# Altium project PirSwitch.PrjPCB
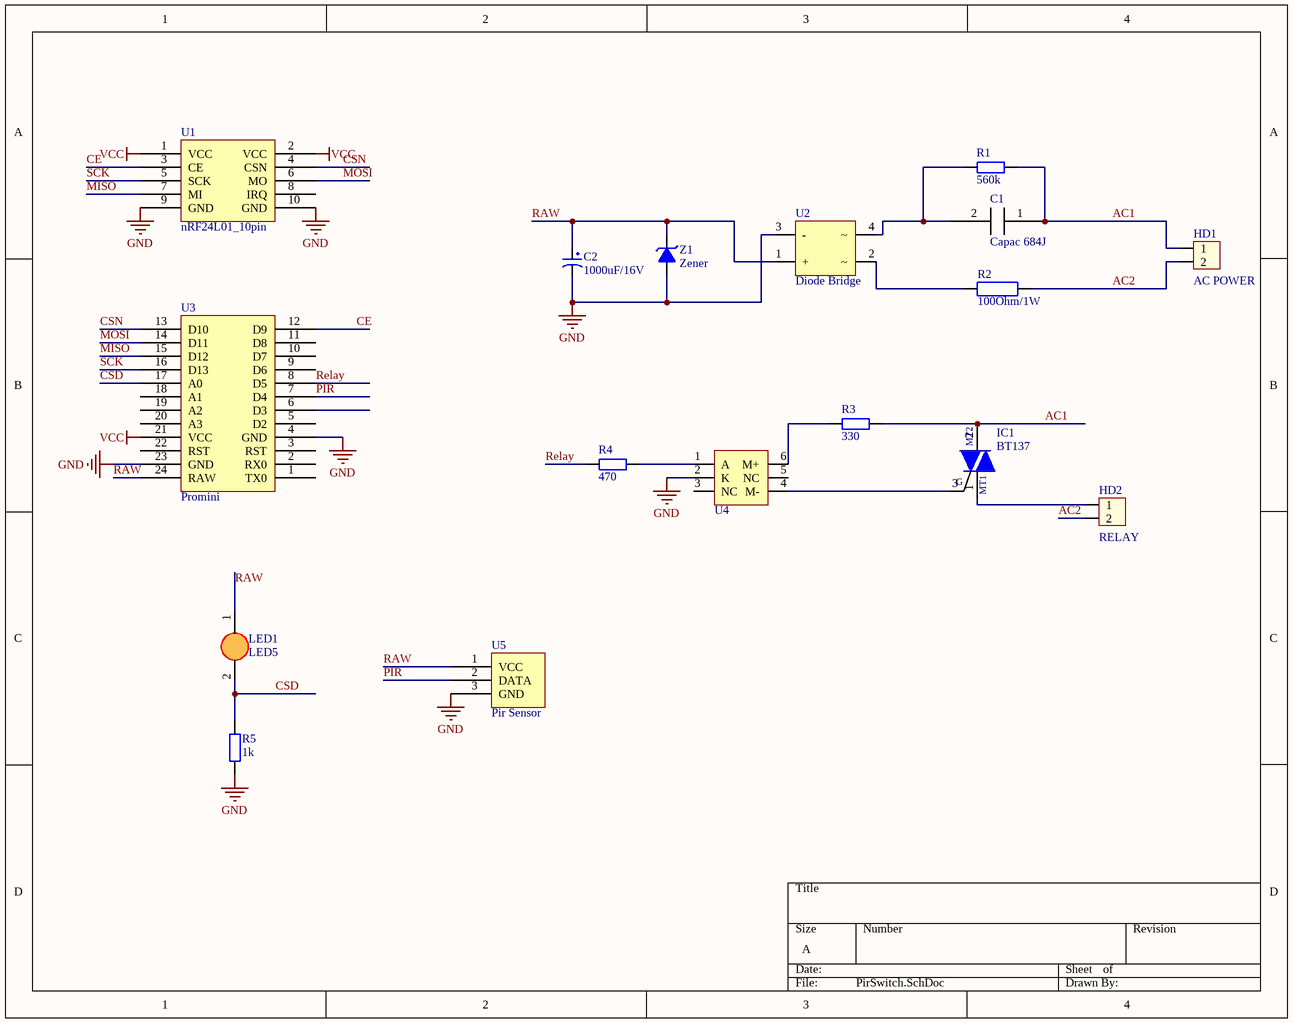
[diagram p0: PirSwitch.SchDoc]
1 sheet, 17 parts. Net scope: global (net labels, ports and power ports of the same name join across sheets).
Board file: PirSwitch.PcbDoc

## Sheet PirSwitch.SchDoc
size A

### Parts
C1  Capac 684J  [Tu keo 684J 400V]
C2  1000uF/16V  [CP2/4]
HD1  AC POWER  [HED2]
HD2  RELAY  [HED2]
IC1  BT137  [QTO-220]
LED1  LED5  [LED5MM]
R1  560k  [R1/4W]
R2  100Ohm/1W  [RES1W]
R3  330  [R1/4W]
R4  470  [R1/4W]
R5  1k  [R1/4W]
U1  nRF24L01_10pin  [NRF24L01_10PIN]
U2  Diode Bridge  [DIODE BRIDGE]
U3  Promini  [Promini]
U4  MOC3021M  [MOC30XX]  (value not drawn)
U5  Pir Sensor  [PIRSENSOR]
Z1  Zener  [D1A]

### Nets
GND: C2.2 R5.1 U1.9(GND) U1.10(GND) U2.3(-) U3.4(GND) U3.23(GND) U4.2(K) U5.3(GND) Z1.1(A)
VCC: U1.1(VCC) U1.2(VCC) U3.21(VCC)
AC1: C1.1 HD1.1 IC1.2(MT2) R1.2 R3.2
AC2: HD1.2 HD2.2 R2.2
CE: U1.3(CE) U3.12(D9)
CSD: LED1.2(K) R5.2 U3.17(A0)
CSN: U1.4(CSN) U3.13(D10)
MISO: U1.7(MI) U3.15(D12)
MOSI: U1.6(MO) U3.14(D11)
PIR: U3.7(D4) U5.2(DATA)
RAW: C2.1 LED1.1(A) U2.1(+) U3.24(RAW) U5.1(VCC) Z1.2(K)
Relay: R4.1 U3.8(D5)
SCK: U1.5(SCK) U3.16(D13)
NetC1_2: C1.2 R1.1 U2.4
NetHD2_1: HD2.1 IC1.1(MT1)
NetIC1_3: IC1.3(IN) U4.4(M-)
NetR2_1: R2.1 U2.2
NetR3_1: R3.1 U4.6(M+)
NetR4_2: R4.2 U4.1(A)

Not connected (* = marked no-connect by the designer): U1 8(IRQ); U3 1(TX0) 2(RX0) 3(RST) 5(D2) 6(D3) 9(D6) 10(D7) 11(D8) 18(A1) 19(A2) 20(A3) 22(RST); U4 3(NC) 5(NC)

### Notes on the sheet
- (in symbol BT137) G

### Library data of the parts
C1 = Tu keo 684J 400V
C2 = CP5: Cap 2200uF/16V - 1000uF/50V; Description 5: 47uF/200V - 22uF/350V - 400V - 10uF/450V; Description 1: 4700uF-6800uF/6,3V - 3300uF-4700uF/10V; Description 2: 2200uF-3300uF/16V - 470uF => 2200uF/25V; Description 3: 1000uF/35V-50V_470uF/63V_220uF>330uF/100V; Description 4: 47uF => 100uF/160V - 33uF-47uF/250V; Value: 2200uF/16V
HD1 HD2 = Hed2: Header 2 (Green); Value: Header 2
IC1 = BT137: Triacs - 8A; Value: LM317
LED1 = LED 5mm
R1 R3-R5 = R1/4W: Resistor 1/4W; Value: R1/4W - 1K
R2 = Res 1W: 1W Res Power; Creator: Nguyen Ba Bien